# Altium schematic sheet MJ_AT6558-1613 V1.0.SchDoc
size A4
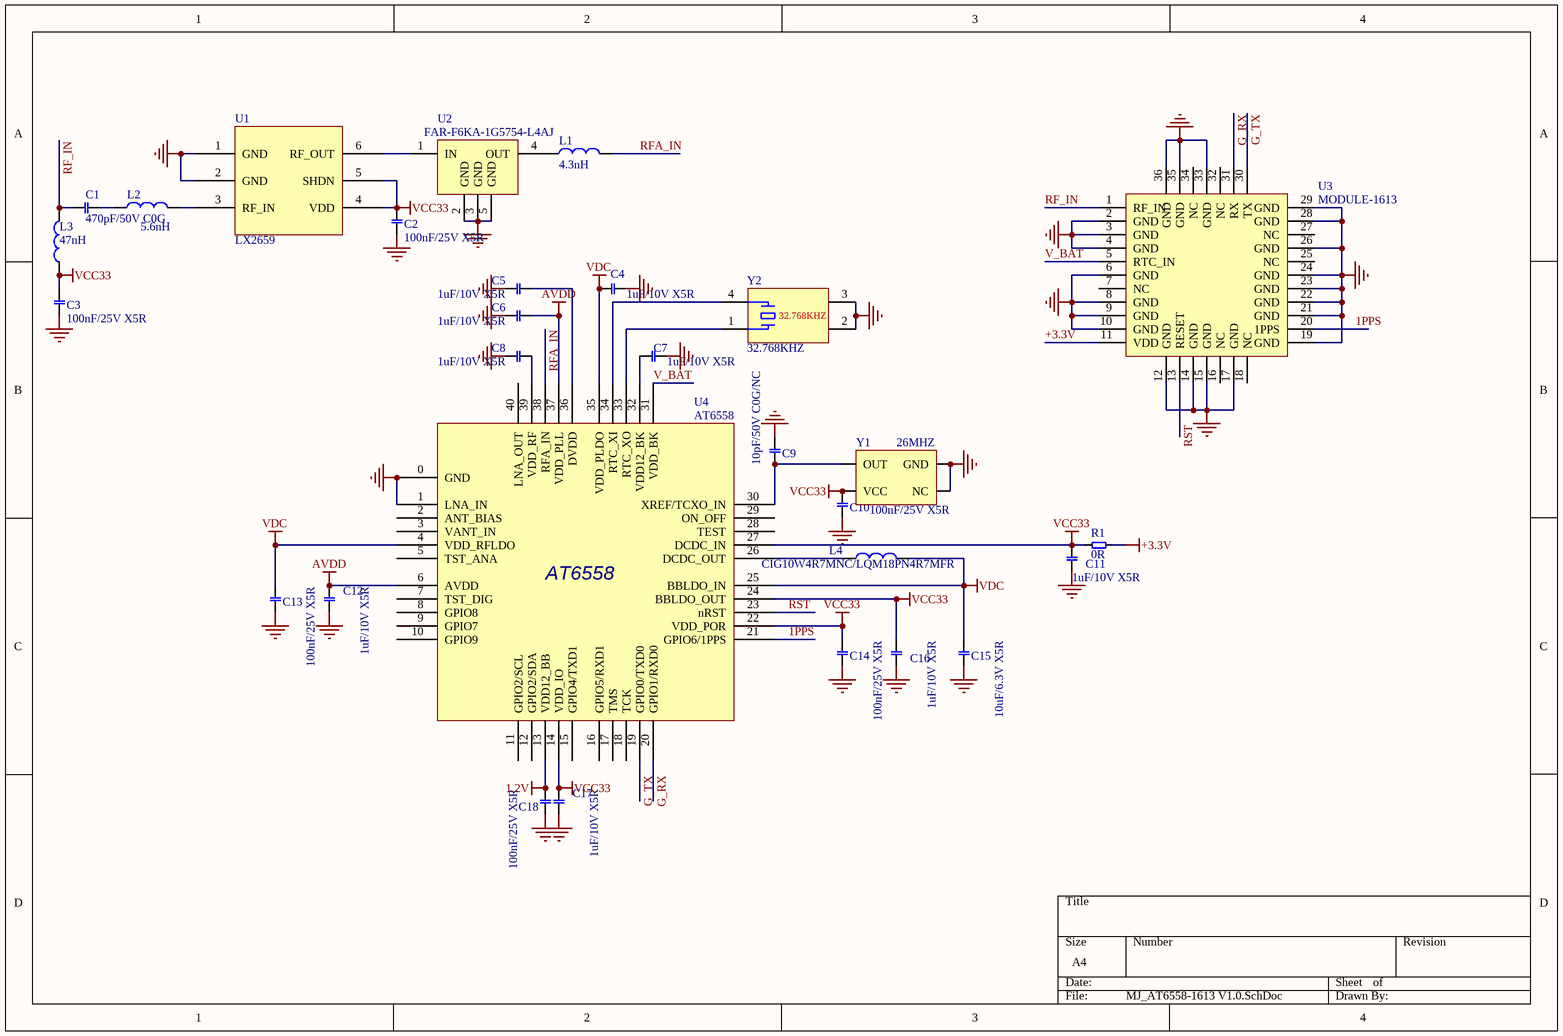
[diagram p0: MJ_AT6558-1613 V1.0.SchDoc]

## Parts
C1  470pF/50V C0G  [0402]
C2  100nF/25V X5R  [0402]
C3  100nF/25V X5R  [0402]
C4  1uF/10V X5R  [0402]
C5  1uF/10V X5R  [0402]
C6  1uF/10V X5R  [0402]
C7  1uF/10V X5R  [0402]
C8  1uF/10V X5R  [0402]
C9  10pF/50V C0G/NC  [0402]
C10  100nF/25V X5R  [0402]
C11  1uF/10V X5R  [0402]
C12  1uF/10V X5R  [0402]
C13  100nF/25V X5R  [0402]
C14  100nF/25V X5R  [0402]
C15  10uF/6.3V X5R  [0603]
C16  1uF/10V X5R  [0402]
C17  1uF/10V X5R  [0402]
C18  100nF/25V X5R  [0402]
L1  4.3nH  [0402]
L2  5.6nH  [0402]
L3  47nH  [0402]
L4  CIG10W4R7MNC/LQM18PN4R7MFR  [0603]
R1  0R  [0402]
U1  LX2659  [dfn-6]
U2  FAR-F6KA-1G5754-L4AJ  [s1365]
U3  MODULE-1613  [MODULE-1613]
U4  AT6558  [AT6558]
Y1  26MHZ  [JZ_TCXO2520]
Y2  32.768KHZ  [JZ-MC146]

## Nets
1.2V: C18.1 U4.13(VDD12_BB)
+3.3V: R1.2 U3.11(VDD)
AVDD: C6.1 C12.1 U4.6(AVDD) U4.37(VDD_PLL)
GND: C2.2 C3.1 C4.2 C5.1 C6.2 C7.2 C8.1 C9.2 C10.2 C11.1 C12.2 C13.2 C14.2 C15.1 C16.1 C17.2 C18.2 U1.1(GND) U1.2(GND) U2.2(GND) U2.3(GND) U2.5(GND) U3.2(GND) U3.3(GND) U3.4(GND) U3.6(GND) U3.8(GND) U3.9(GND) U3.10(GND) U3.12(GND) U3.14(GND) U3.15(GND) U3.17(GND) U3.19(GND) U3.21(GND) U3.22(GND) U3.23(GND) U3.24(GND) U3.26(GND) U3.28(GND) U3.29(GND) U3.33(GND) U3.35(GND) U3.36(GND) U4.0(GND) U4.1(LNA_IN) Y1.1(NC) Y1.2(GND) Y2.2 Y2.3
VCC33: C2.1 C3.2 C10.1 C11.2 C14.1 C16.2 C17.1 L3.2 R1.1 U1.4(VDD) U1.5(SHDN) U4.14(VDD_IO) U4.22(VDD_POR) U4.24(BBLDO_OUT) U4.27(DCDC_IN) Y1.4(VCC)
VDC: C4.1 C13.1 C15.2 L4.1 U4.4(VDD_RFLDO) U4.25(BBLDO_IN) U4.35(VDD_PLDO)
1PPS: U3.20(1PPS) U4.21(GPIO6/1PPS)
G_RX: U3.31(RX) U4.20(GPIO1/RXD0)
G_TX: U3.30(TX) U4.19(GPIO0/TXD0)
RF_IN: C1.1 L3.1 U3.1(RF_IN)
RFA_IN: L1.1 U4.38(RFA_IN)
RST: U3.13(RESET) U4.23(nRST)
V_BAT: U3.5(RTC_IN) U4.31(VDD_BK)
NetC1_2: C1.2 L2.2
NetC5_2: C5.2 U4.36(DVDD)
NetC7_1: C7.1 U4.32(VDD12_BK)
NetC8_2: C8.2 U4.39(VDD_RF)
NetC9_1: C9.1 U4.30(XREF/TCXO_IN) Y1.3(OUT)
NetL1_2: L1.2 U2.4(OUT)
NetL2_1: L2.1 U1.3(RF_IN)
NetL4_2: L4.2 U4.26(DCDC_OUT)
NetU1_6: U1.6(RF_OUT) U2.1(IN)
NetU4_33: U4.33(RTC_XO) Y2.1
NetU4_34: U4.34(RTC_XI) Y2.4

Not connected (* = marked no-connect by the designer): U3 7(NC) 16(NC) 18(NC) 25(NC) 27(NC) 32(NC) 34(NC); U4 2(ANT_BIAS) 3(VANT_IN) 5(TST_ANA) 7(TST_DIG) 8(GPIO8) 9(GPIO7) 10(GPIO9) 11(GPIO2/SCL) 12(GPIO2/SDA) 15(GPIO4/TXD1) 16(GPIO5/RXD1) 17(TMS) 18(TCK) 28(TEST) 29(ON_OFF) 40(LNA_OUT)

## Library data of the parts
C1-C18 = CB
L1-L3 = L1
L4 = L1: SAMSUNG/MURATA
R1 = R
U2 = SAW FILTER 1575
U4 = AT6558: AT6558 QFN40 5*5*0.8
Y1 = XTAL